# Altium schematic sheet Placa_ADA.SchDoc
size A3
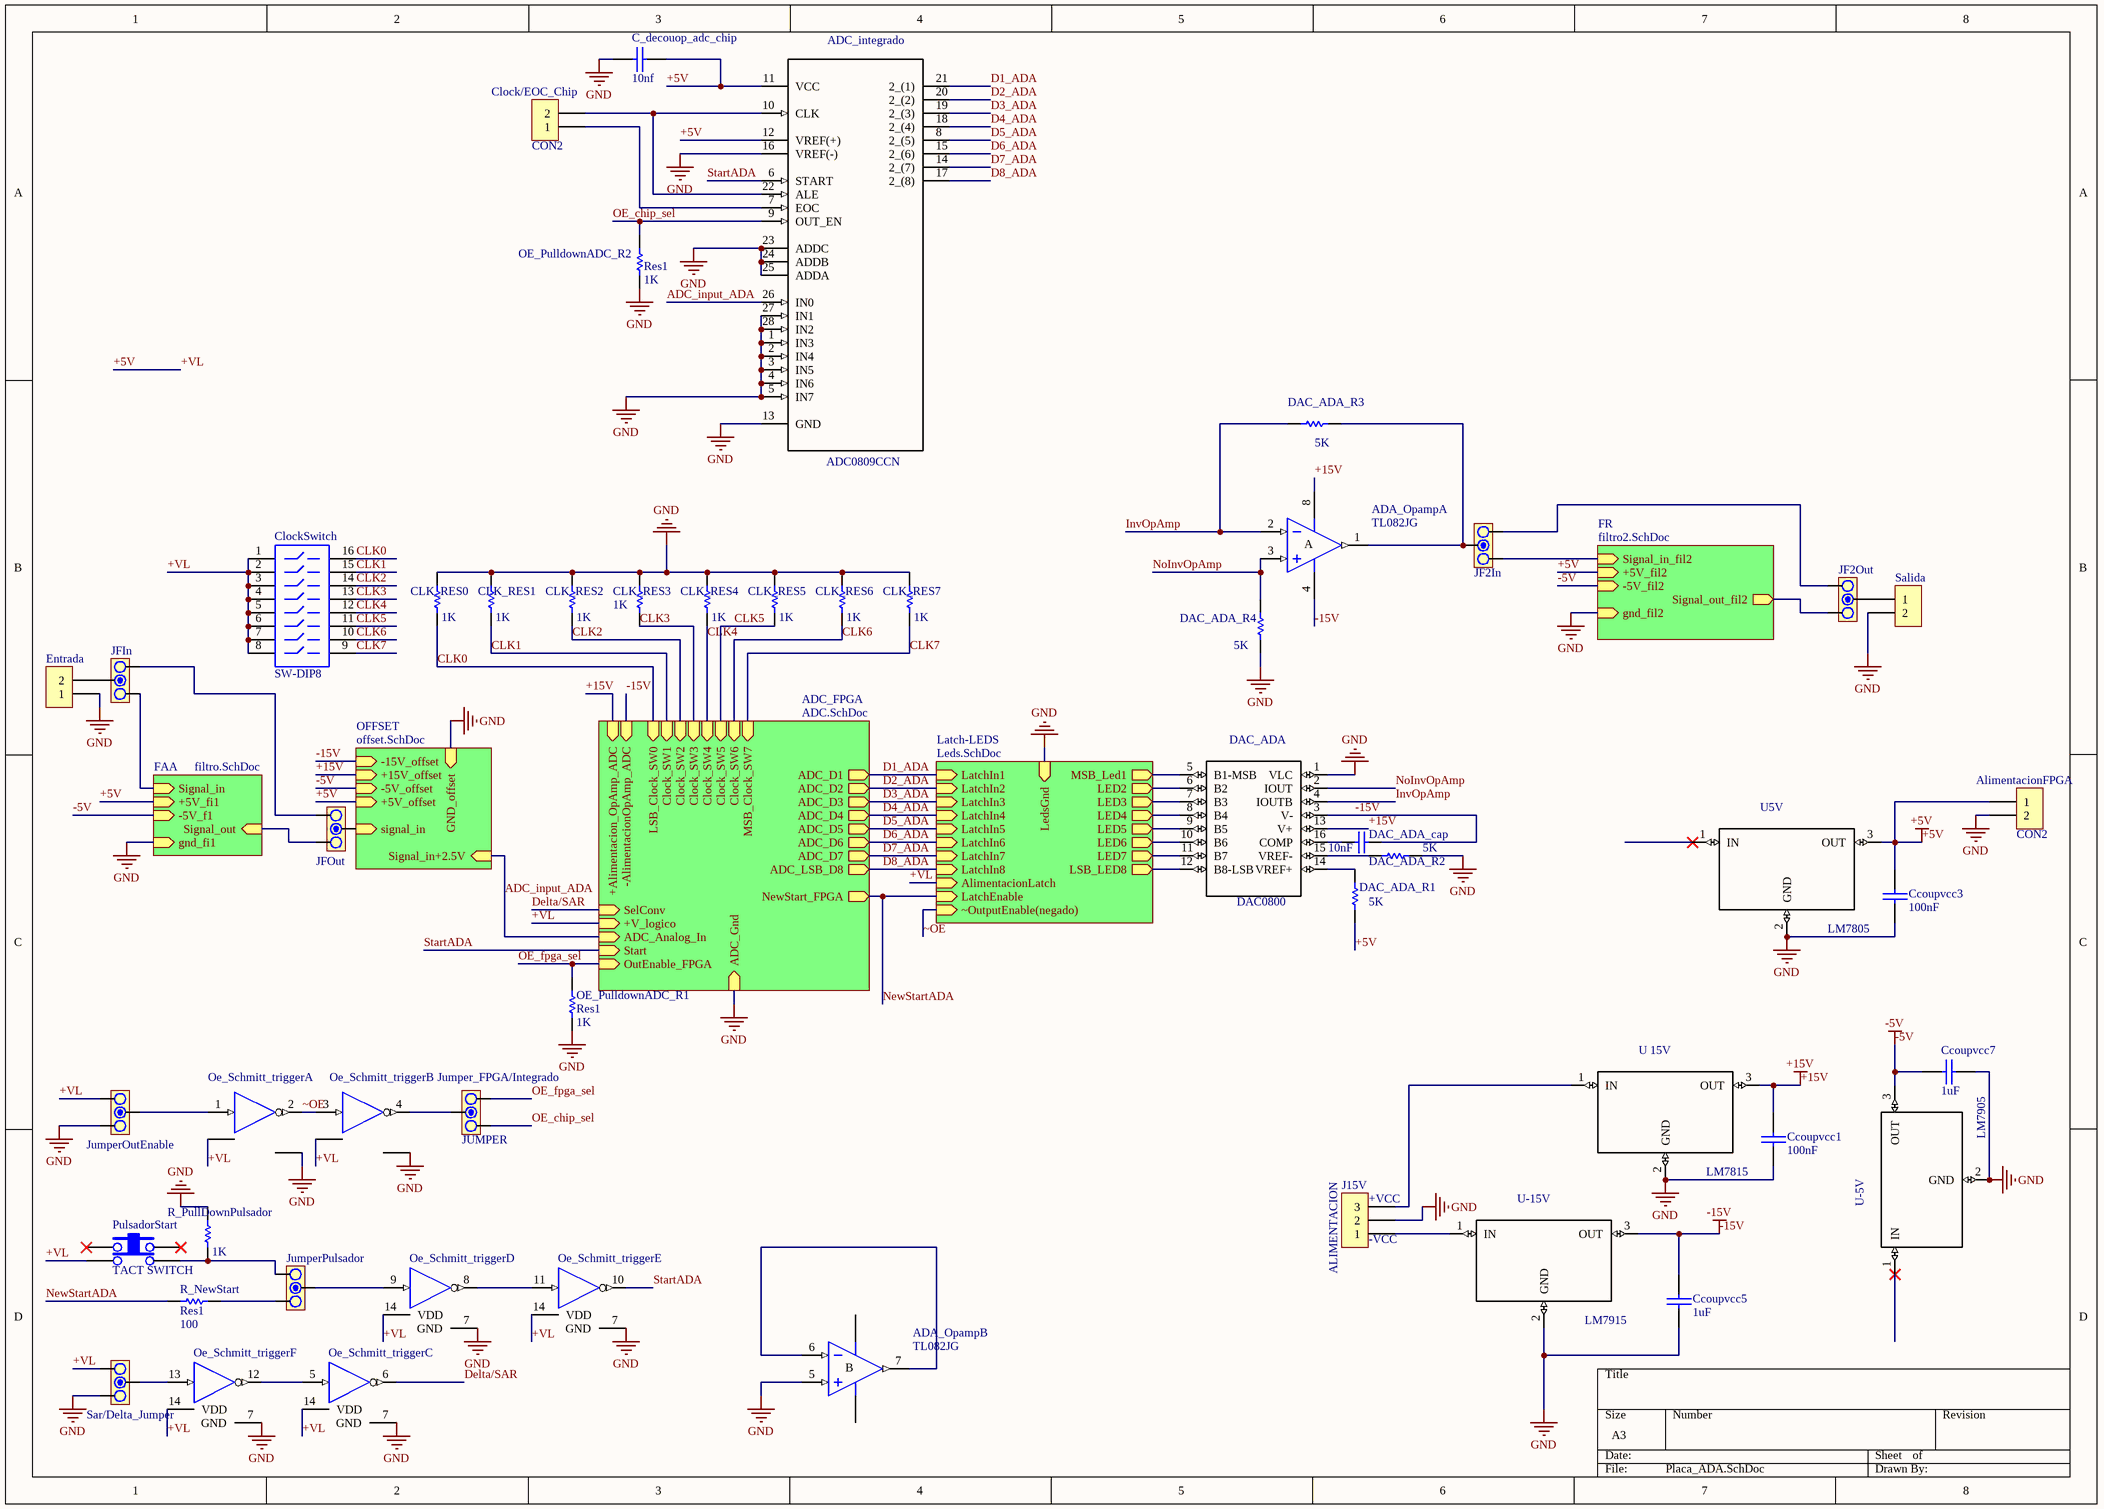
[diagram p0: Placa_ADA.SchDoc]

## Parts
ADA_Opamp  TL082JG  [JG008]  (parts A,B of 2)
ADC_integrado  ADC0809CCN  [*DIP254P1524X483-28]
AlimentacionFPGA  CON2  [SIP2]
C_decouop_adc_chip  10nf  [CAP200]
Ccoupvcc1  100nF  [CAP200]
Ccoupvcc3  100nF  [CAP200]
Ccoupvcc5  1uF  [CAP200]
Ccoupvcc7  1uF  [CAP200]
CLK_RES0  value 1K  [AXIAL-0.3]  (hidden comment: Res1)
CLK_RES1  value 1K  [AXIAL-0.3]  (hidden comment: Res1)
CLK_RES2  value 1K  [AXIAL-0.3]  (hidden comment: Res1)
CLK_RES3  value 1K  [AXIAL-0.3]  (hidden comment: Res1)
CLK_RES4  value 1K  [AXIAL-0.3]  (hidden comment: Res1)
CLK_RES5  value 1K  [AXIAL-0.3]  (hidden comment: Res1)
CLK_RES6  value 1K  [AXIAL-0.3]  (hidden comment: Res1)
CLK_RES7  value 1K  [AXIAL-0.3]  (hidden comment: Res1)
Clock/EOC_Chip  CON2  [SIP2]
ClockSwitch  SW-DIP8  [DIP-16-KEY]
DAC_ADA  DAC0800  [*DIL16]
DAC_ADA_cap  value 10nF  [RAD-0.3]  (hidden comment: Cap)
DAC_ADA_R1  value 5K  [AXIAL-0.3]  (hidden comment: Res1)
DAC_ADA_R2  value 5K  [AXIAL-0.3]  (hidden comment: Res1)
DAC_ADA_R3  value 5K  [AXIAL-0.3]  (hidden comment: Res1)
DAC_ADA_R4  value 5K  [AXIAL-0.3]  (hidden comment: Res1)
Entrada  BORNERA 2  [BORNERA2]  (value not drawn)
J15V  ALIMENTACION  [BORNERA3]
JF2In  JUMPER  [JUMPER3]  (value not drawn)
JF2Out  JUMPER  [JUMPER3]  (value not drawn)
JFIn  JUMPER  [JUMPER3]  (value not drawn)
JFOut  JUMPER  [JUMPER3]  (value not drawn)
Jumper_FPGA/Integrado  JUMPER  [JUMPER3]
JumperOutEnable  JUMPER  [JUMPER3]  (value not drawn)
JumperPulsador  JUMPER  [JUMPER3]  (value not drawn)
OE_PulldownADC_R1  Res1  value 1K  [AXIAL-0.3]
OE_PulldownADC_R2  Res1  value 1K  [AXIAL-0.3]
Oe_Schmitt_trigger  MC74HC14AN  [646-06]  (value not drawn)  (parts A,B,C,D,E,F of 6)
PulsadorStart  TACT SWITCH  [TACTSWITCH]
R_NewStart  Res1  value 100  [AXIAL-0.3]
R_PullDownPulsador  value 1K  [AXIAL-0.3]  (hidden comment: Res1)
Salida  BORNERA 2  [BORNERA2]  (value not drawn)
Sar/Delta_Jumper  JUMPER  [JUMPER3]  (value not drawn)
U5V  LM7805  [*TO220]
U-5V  LM7905  [*TO220]
U-15V  LM7915  [*TO220]
U_15V  LM7815  [*TO220]

## Sub-sheets
ADC_FPGA = ADC.SchDoc: +V_logico (in), Clock_SW1 (in), Clock_SW2 (in), Clock_SW3 (in), Clock_SW4 (in), Clock_SW6 (in), LSB_Clock_SW0 (in), MSB_Clock_SW7 (in), ADC_Analog_In (in), Start (in), ADC_LSB_D8 (out), ADC_D7 (out), ADC_D6 (out), ADC_D5 (out), ADC_D4 (out), ADC_D3 (out), ADC_D2 (out), ADC_D1 (out), OutEnable_FPGA (in), ADC_Gnd (in), Clock_SW5 (in), NewStart_FPGA (out), SelConv (in), -AlimentacionOpAmp_ADC (in), +Alimentacion_OpAmp_ADC (in)
FAA = filtro.SchDoc: Signal_in (in), Signal_out (in), +5V_fi1 (in), -5V_f1 (in), gnd_fi1 (in)
FR = filtro2.SchDoc: Signal_in_fil2 (in), Signal_out_fil2 (out), +5V_fil2 (in), -5V_fil2 (in), gnd_fil2 (in)
Latch-LEDS = Leds.SchDoc: LatchIn1 (in), LatchIn2 (in), LatchIn3 (in), LatchIn4 (in), LatchIn5 (in), LatchIn6 (in), LatchIn7 (in), LatchIn8 (in), MSB_Led1 (out), LED2 (out), LED3 (out), LED4 (out), LED5 (out), LED6 (out), LED7 (out), LSB_LED8 (out), AlimentacionLatch (in), LatchEnable (in), LedsGnd (in), ~OutputEnable(negado) (in)
OFFSET = offset.SchDoc: -15V_offset (in), Signal_in+2.5V (in), +15V_offset (in), -5V_offset (in), +5V_offset (in), GND_offset (in), signal_in (in)

## Nets
+5V: ADC_integrado.11(VCC) ADC_integrado.12(VREF(+)) AlimentacionFPGA.1 C_decouop_adc_chip.2 Ccoupvcc3.1 ClockSwitch.1 ClockSwitch.2 ClockSwitch.3 ClockSwitch.4 ClockSwitch.5 ClockSwitch.6 ClockSwitch.7 ClockSwitch.8 DAC_ADA_R1.1 JumperOutEnable.3 Oe_Schmitt_trigger.14(VDD) PulsadorStart.2 Sar/Delta_Jumper.3 U5V.3(OUT) ; sheet ADC_FPGA/+V_logico, sheet Latch-LEDS/AlimentacionLatch, sheet FAA/+5V_fi1, sheet OFFSET/+5V_offset, sheet FR/+5V_fil2  [also labelled +VL, VDD]
+15V: ADA_Opamp.8(V+) Ccoupvcc1.1 DAC_ADA.13(V+) U_15V.3(OUT) ; sheet ADC_FPGA/+Alimentacion_OpAmp_ADC, sheet OFFSET/+15V_offset
-5V: Ccoupvcc7.1 U-5V.3(OUT) ; sheet FAA/-5V_f1, sheet OFFSET/-5V_offset, sheet FR/-5V_fil2
-15V: ADA_Opamp.4(V-) Ccoupvcc5.1 DAC_ADA.3(V-) DAC_ADA_cap.2 U-15V.3(OUT) ; sheet ADC_FPGA/-AlimentacionOpAmp_ADC, sheet OFFSET/-15V_offset
GND: ADA_Opamp.5(IN+) ADC_integrado.1(IN3) ADC_integrado.2(IN4) ADC_integrado.3(IN5) ADC_integrado.4(IN6) ADC_integrado.5(IN7) ADC_integrado.13(GND) ADC_integrado.16(VREF(-)) ADC_integrado.23(ADDC) ADC_integrado.24(ADDB) ADC_integrado.25(ADDA) ADC_integrado.27(IN1) ADC_integrado.28(IN2) AlimentacionFPGA.2 C_decouop_adc_chip.1 Ccoupvcc1.2 Ccoupvcc3.2 Ccoupvcc5.2 Ccoupvcc7.2 CLK_RES0.2 CLK_RES1.2 CLK_RES2.2 CLK_RES3.2 CLK_RES4.2 CLK_RES5.2 CLK_RES6.2 CLK_RES7.2 DAC_ADA.1(VLC) DAC_ADA_R2.2 DAC_ADA_R4.1 Entrada.1 J15V.2 JumperOutEnable.1 OE_PulldownADC_R1.1 OE_PulldownADC_R2.1 Oe_Schmitt_trigger.7(GND) R_PullDownPulsador.2 Salida.2 Sar/Delta_Jumper.1 U5V.2(GND) U-5V.2(GND) U-15V.2(GND) U_15V.2(GND) ; sheet ADC_FPGA/ADC_Gnd, sheet Latch-LEDS/LedsGnd, sheet FAA/gnd_fi1, sheet OFFSET/GND_offset, sheet FR/gnd_fil2
ADC_input_ADA: ADC_integrado.26(IN0) ; sheet ADC_FPGA/ADC_Analog_In, sheet OFFSET/Signal_in+2.5V
CLK0: CLK_RES0.1 ClockSwitch.16 ; sheet ADC_FPGA/LSB_Clock_SW0
CLK1: CLK_RES1.1 ClockSwitch.15 ; sheet ADC_FPGA/Clock_SW1
CLK2: CLK_RES2.1 ClockSwitch.14 ; sheet ADC_FPGA/Clock_SW2
CLK3: CLK_RES3.1 ClockSwitch.13 ; sheet ADC_FPGA/Clock_SW3
CLK4: CLK_RES4.1 ClockSwitch.12 ; sheet ADC_FPGA/Clock_SW4
CLK5: CLK_RES5.1 ClockSwitch.11 ; sheet ADC_FPGA/Clock_SW5
CLK6: CLK_RES6.1 ClockSwitch.10 ; sheet ADC_FPGA/Clock_SW6
CLK7: CLK_RES7.1 ClockSwitch.9 ; sheet ADC_FPGA/MSB_Clock_SW7
D1_ADA: ADC_integrado.21(2_(1)) ; sheet ADC_FPGA/ADC_D1, sheet Latch-LEDS/LatchIn1
D2_ADA: ADC_integrado.20(2_(2)) ; sheet ADC_FPGA/ADC_D2, sheet Latch-LEDS/LatchIn2
D3_ADA: ADC_integrado.19(2_(3)) ; sheet ADC_FPGA/ADC_D3, sheet Latch-LEDS/LatchIn3
D4_ADA: ADC_integrado.18(2_(4)) ; sheet ADC_FPGA/ADC_D4, sheet Latch-LEDS/LatchIn4
D5_ADA: ADC_integrado.8(2_(5)) ; sheet ADC_FPGA/ADC_D5, sheet Latch-LEDS/LatchIn5
D6_ADA: ADC_integrado.15(2_(6)) ; sheet ADC_FPGA/ADC_D6, sheet Latch-LEDS/LatchIn6
D7_ADA: ADC_integrado.14(2_(7)) ; sheet ADC_FPGA/ADC_D7, sheet Latch-LEDS/LatchIn7
D8_ADA: ADC_integrado.17(2_(8)) ; sheet ADC_FPGA/ADC_LSB_D8, sheet Latch-LEDS/LatchIn8
Delta/SAR: Oe_Schmitt_trigger.6(~{OUT}) ; sheet ADC_FPGA/SelConv
InvOpAmp: ADA_Opamp.2(IN-) DAC_ADA.4(IOUTB) DAC_ADA_R3.1
NewStartADA: R_NewStart.1 ; sheet ADC_FPGA/NewStart_FPGA, sheet Latch-LEDS/LatchEnable
NoInvOpAmp: ADA_Opamp.3(IN+) DAC_ADA.2(IOUT) DAC_ADA_R4.2
OE_chip_sel: ADC_integrado.9(OUT_EN) Jumper_FPGA/Integrado.3 OE_PulldownADC_R2.2
OE_fpga_sel: Jumper_FPGA/Integrado.1 OE_PulldownADC_R1.2 ; sheet ADC_FPGA/OutEnable_FPGA
StartADA: ADC_integrado.6(START) Oe_Schmitt_trigger.10(~{OUT}) ; sheet ADC_FPGA/Start
~OE: Oe_Schmitt_trigger.2(~{OUT}) Oe_Schmitt_trigger.3(IN) ; sheet Latch-LEDS/~OutputEnable(negado)
NetADA_Opamp_1: ADA_Opamp.1(OUT) DAC_ADA_R3.2 JF2In.2
NetADA_Opamp_6: ADA_Opamp.6(IN-) ADA_Opamp.7(OUT)
NetADC_integrado_7: ADC_integrado.7(EOC) Clock/EOC_Chip.1
NetADC_integrado_10: ADC_integrado.10(CLK) ADC_integrado.22(ALE) Clock/EOC_Chip.2
NetDAC_ADA_5: DAC_ADA.5(B1-MSB) ; sheet Latch-LEDS/MSB_Led1
NetDAC_ADA_6: DAC_ADA.6(B2) ; sheet Latch-LEDS/LED2
NetDAC_ADA_7: DAC_ADA.7(B3) ; sheet Latch-LEDS/LED3
NetDAC_ADA_8: DAC_ADA.8(B4) ; sheet Latch-LEDS/LED4
NetDAC_ADA_9: DAC_ADA.9(B5) ; sheet Latch-LEDS/LED5
NetDAC_ADA_10: DAC_ADA.10(B6) ; sheet Latch-LEDS/LED6
NetDAC_ADA_11: DAC_ADA.11(B7) ; sheet Latch-LEDS/LED7
NetDAC_ADA_12: DAC_ADA.12(B8-LSB) ; sheet Latch-LEDS/LSB_LED8
NetDAC_ADA_14: DAC_ADA.14(VREF+) DAC_ADA_R1.2
NetDAC_ADA_15: DAC_ADA.15(VREF-) DAC_ADA_R2.1
NetDAC_ADA_16: DAC_ADA.16(COMP) DAC_ADA_cap.1
NetEntrada_2: Entrada.2 JFIn.2
NetJ15V_1: J15V.1 U-15V.1(IN)
NetJ15V_3: J15V.3 U_15V.1(IN)
NetJF2In_1: JF2In.1 JF2Out.3
NetJF2In_3: JF2In.3 ; sheet FR/Signal_in_fil2
NetJF2Out_1: JF2Out.1 ; sheet FR/Signal_out_fil2
NetJF2Out_2: JF2Out.2 Salida.1
NetJFIn_1: JFIn.1 JFOut.3
NetJFIn_3: JFIn.3 ; sheet FAA/Signal_in
NetJFOut_1: JFOut.1 ; sheet FAA/Signal_out
NetJFOut_2: JFOut.2 ; sheet OFFSET/signal_in
NetJumper_FPGA/Integrado_2: Jumper_FPGA/Integrado.2 Oe_Schmitt_trigger.4(~{OUT})
NetJumperOutEnable_2: JumperOutEnable.2 Oe_Schmitt_trigger.1(IN)
NetJumperPulsador_1: JumperPulsador.1 R_NewStart.2
NetJumperPulsador_2: JumperPulsador.2 Oe_Schmitt_trigger.9(IN)
NetJumperPulsador_3: JumperPulsador.3 PulsadorStart.4 R_PullDownPulsador.1
NetOe_Schmitt_trigger_5: Oe_Schmitt_trigger.5(IN) Oe_Schmitt_trigger.12(~{OUT})
NetOe_Schmitt_trigger_8: Oe_Schmitt_trigger.8(~{OUT}) Oe_Schmitt_trigger.11(IN)
NetOe_Schmitt_trigger_13: Oe_Schmitt_trigger.13(IN) Sar/Delta_Jumper.2

Not connected (* = marked no-connect by the designer): PulsadorStart 1* 3*; U5V 1(IN)*; U-5V 1(IN)*

## Notes on the sheet
- (near J15V) +VCC
- (near J15V) -VCC
- (in symbol TL082JG, part A) A
- (in symbol TL082JG, part B) B

## Library data of the parts
ADA_Opamp = TL082JG: JFET-Input Operational Amplifier; Published: 16-Jan-2001; LatestRevisionDate: 04-Mar-2005; LatestRevisionNote: Stylized 3D Model Added.; DatasheetVersion: Feb-1999; PackageVersion: Jan-1995; PackageReference: JG008; Publisher: Altium Limited; PackageDescription: DIP; 8 Leads; Row Spacing 7.62 mm; Pitch 2.54 mm; ComponentLink1Description: Manufacturer Link; ComponentLink1URL: http://www.ti.com/; ComponentLink2Description: Datasheet; ComponentLink2URL: http://www-s.ti.com/sc/ds/tl082.pdf
ADC_integrado = ADC0809CCN: 8-bit Microprocessor Compatible A/D Converters With 8-Channel Multiplexer 28-PDIP -40 to 85; MP: ADC0809CCN/NOPB; MF: Texas Instruments; Availability: Unavailable; SnapEDA_Link: https://www.snapeda.com/parts/ADC0809CCN/NOPB/Texas%20Instruments/view-part/?ref=snap; Price: None; Package: DIP-28 Texas Instruments; Value: *
C_decouop_adc_chip Ccoupvcc1 Ccoupvcc3 Ccoupvcc5 Ccoupvcc7 = CAP
CLK_RES0-CLK_RES7 DAC_ADA_R1-DAC_ADA_R4 OE_PulldownADC_R1 OE_PulldownADC_R2 R_NewStart R_PullDownPulsador = Res1: Resistor; Published: 8-Jun-2000; LatestRevisionDate: 17-Jul-2002; LatestRevisionNote: Re-released for DXP Platform.; PackageReference: AXIAL-0.3; Publisher: Altium Limited; PackageDescription: Axial Device, Thru-Hole; 2 Leads; 0.3 in Pin Spacing
ClockSwitch = SW-DIP8: 4009 Series DIP Switch, Raised actuator; Published: 24-Mar-1999; LatestRevisionDate: 17-Dec-2003; LatestRevisionNote: PCB Footprint replaced.; PackageReference: DIP-16-KEY; Publisher: Altium Limited; PackageDescription: DIP; 16 Leads; Row Spacing 7.62 mm; Pitch 2.54 mm; ComponentLink1Description: Manufacturer Link; ComponentLink1URL: http://www.oupiin.com/prodindx.html#Headers
DAC_ADA = DAC0800: MF: Texas Instruments; SnapEDA_Link: https://www.snapeda.com/parts/DAC0800/Texas%20Instruments/view-part/?ref=snap; MP: DAC0800; Package: SOIC-16 Texas Instruments; Digi-Key_Part_Number: DAC0800LCN/NOPB-ND; Digi-Key_Purchase_URL: https://www.digikey.com.ar/product-detail/en/texas-instruments/DAC0800LCN-NOPB/DAC0800LCN-NOPB-ND/4652?utm_source=snapeda&utm_medium=aggregator&utm_campaign=symbol; Value: *
DAC_ADA_cap = Cap: Capacitor; Published: 8-Jun-2000; LatestRevisionDate: 17-Jul-2002; LatestRevisionNote: Re-released for DXP Platform.; PackageReference: RAD-0.3; Publisher: Altium Limited; PackageDescription: Radial Cap, Thru-Hole; 2 Leads; 0.3 in Pin Spacing
J15V = BORNERA 3
JF2In JF2Out JFIn JFOut Jumper_FPGA/Integrado JumperOutEnable JumperPulsador Sar/Delta_Jumper = JUMPER3
Oe_Schmitt_trigger = MC74HC14AN: Hex Schmitt-Trigger Inverter; Published: 15-Apr-2002; DatasheetVersion: Mar-2000; PackageVersion: 1995; PackageReference: 646-06; Publisher: Altium Limited; PackageDescription: DIP; 14 Leads; Row Spacing 7.62 mm; Pitch 2.54 mm; ComponentLink1Description: Manufacturer Link; ComponentLink1URL: http://www.onsemi.com/; ComponentLink2Description: Datasheet; ComponentLink2URL: http://www.onsemi.com/pub/Collateral/MC74HC14A-D.PDF
U5V U-5V U-15V U_15V = LM7805: MF: Texas Instruments; SnapEDA_Link: https://www.snapeda.com/parts/LM7805/Texas%20Instruments/view-part/?ref=snap; MP: LM7805; Availability: Unavailable; Package: TO-220 Texas Instruments; Price: None; Value: *